# EAGLE design AND_D001A (EAGLE 7.4.0)
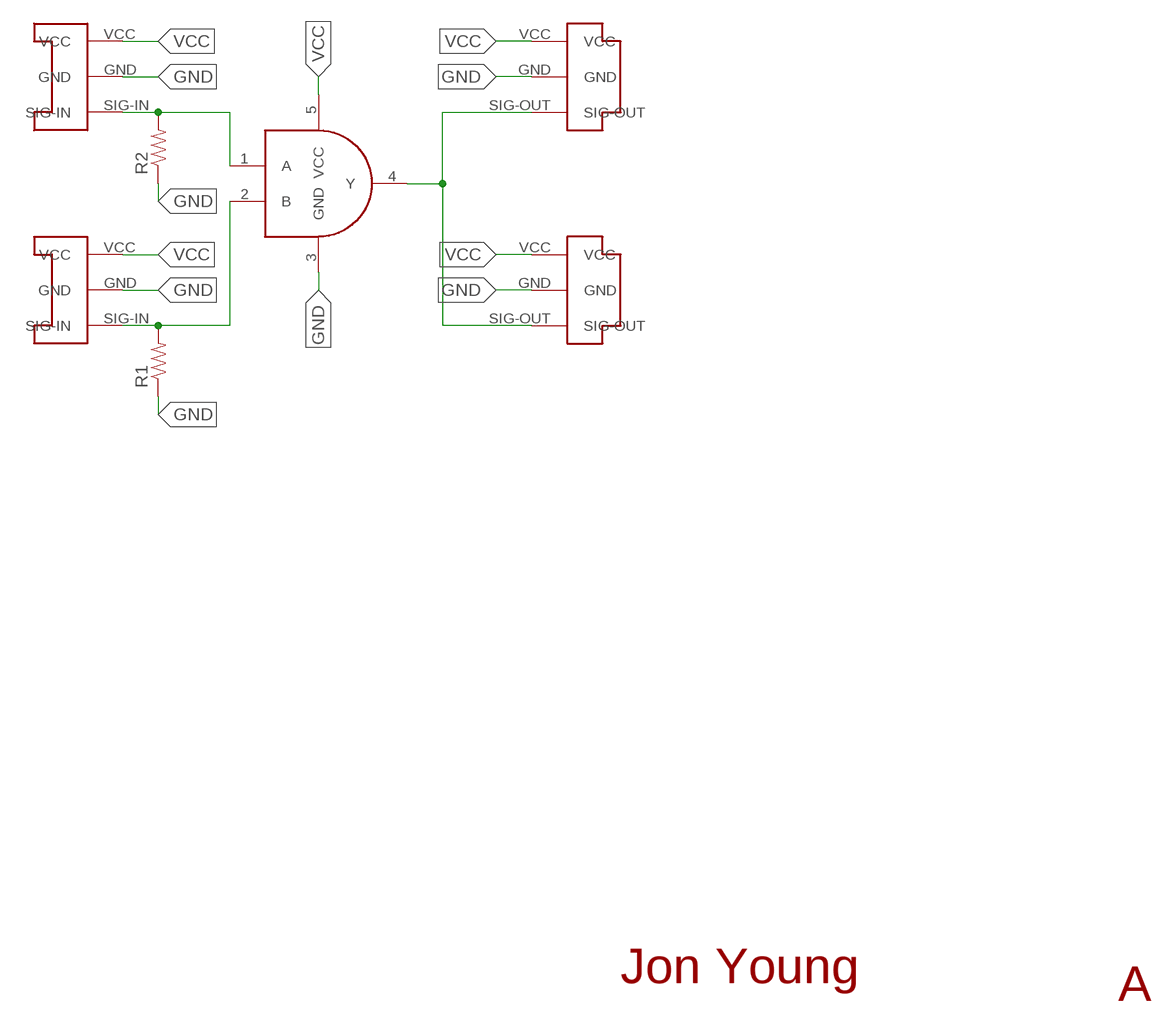
[diagram p0: schematic, sheet 1]

## Parts
R1  RESISTOR0603  [0603-RES]
R2  RESISTOR0603  [0603-RES]
U$1  CONN-PLUG-3POS-3MM  [PLUG-3POS-3MM-SMD]
U$2  CONN-SOCKET-3POS-3MM  [SOCKET-3POS-3MM-SMD]
U$3  CONN-SOCKET-3POS-3MM  [SOCKET-3POS-3MM-SMD]
U$4  CONN-PLUG-3POS-3MM  [PLUG-3POS-3MM-SMD]
U$5  AND-NC7SZ08  [SC70]

## Nets
GND: R1.1 R2.1 U$1.GND U$2.GND U$3.GND U$4.GND U$5.3(GND)
N$6: R1.2 U$2.SIG-IN U$5.2(B)
N$8: R2.2 U$3.SIG-IN U$5.1(A)
SIG-OUT: U$1.SIG-OUT U$4.SIG-OUT U$5.4(Y)
VCC: U$1.VCC U$2.VCC U$3.VCC U$4.VCC U$5.5(VCC)

## Notes on the sheet
- Jon Young
- A

## Library data of the parts
R1 R2 = SparkFun-Resistors:RESISTOR: Resistor Basic schematic elements and footprints for 0603, 1206, and PTH resistors.
U$1 U$4 = EmbeddedPlayground:CONN-PLUG-3POS-3MM: Surface mount board to board connector. Female socket, 3 position.
U$2 U$3 = EmbeddedPlayground:CONN-SOCKET-3POS-3MM: Surface mount board to board connector. Female socket, 3 position.
U$5 = EmbeddedPlayground:AND-NC7SZ08

## Board
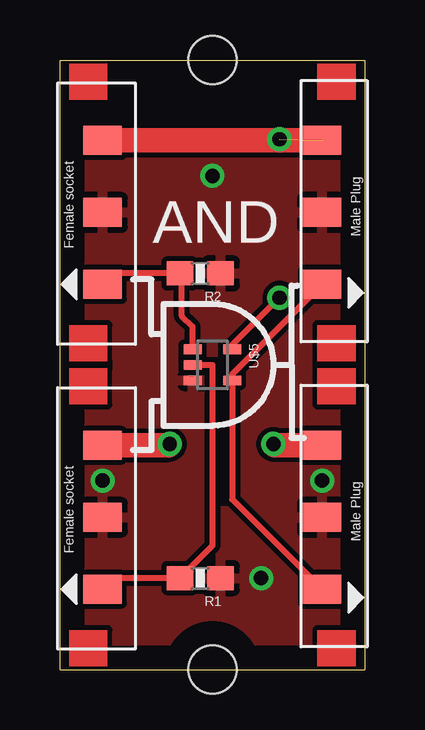
[diagram p1: board, top side]
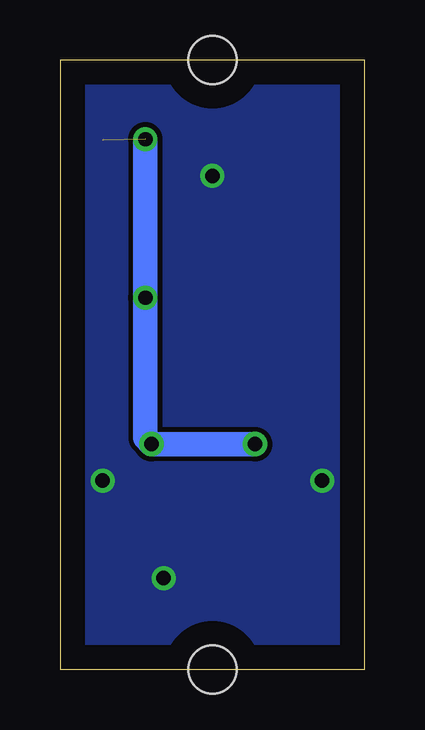
[diagram p2: board, bottom side, seen from below]

Size 12.7 x 25.4 mm. Coordinates in mm from the lower left corner, seen from the top.
Outline: 0,0 12.7,0 12.7,25.4 0,25.4 0,0
Copper layers (1*16): Top 0.035mm / dielectric 1.5mm / Bottom 0.035mm
Design rules "default": minimum track width 10mil, minimum drill 24mil, track to track 8mil, track to pad 8mil, pad to pad 8mil, via to via 8mil, smd to smd 8mil, copper to edge 40mil, drill to drill 8mil, minimum pad ring 10mil, minimum via ring 8mil, stop-mask expansion 4mil, vias tented up to drill 0mil, thermal gap 10mil
Holes 2 mm at 6.35,0 6.35,25.4

### Footprints (pad centres in the part's own frame; a part is rotated, then mirrored left to right if it is on the bottom)
0603-RES = smd 1.1 x 1: 1 -0.85,0; 2 0.85,0
PLUG-3POS-3MM-SMD = smd 1.2 x 1.6: GND 0,0; SIG-OUT 3,0; VCC -3,0
SOCKET-3POS-3MM-SMD = smd 1.2 x 1.6: GND 0,0; SIG-IN -3,0; VCC 3,0
SC70 = smd 0.4 x 0.75: 1 -0.65,-0.825; 2 0,-0.825; 3 0.65,-0.825; 4 0.65,0.825; 5 -0.65,0.825

### Placement (x,y rotation side)
R1  5.84,3.81 180 top
R2  5.84,16.51 180 top
U$1  10.92,6.35 270 top
U$2  1.78,6.35 90 top
U$3  1.78,19.05 90 top
U$4  10.92,19.05 270 top
U$5  6.35,12.7 270 top

### Tracks (layer width: path | path; a pad name or v marks a point on that pad's centre or on a via)
GND  (via drill 0.6)
  other vias: 1.78,7.87 10.92,7.87 8.38,3.81 6.35,20.57
  pour Top: -1.27,31.69 -1.27,-1.27 16.42,-1.27 16.42,31.69
  pour Bottom: -1.27,31.69 16.42,31.69 16.42,-1.27 -1.27,-1.27
N$6
  Top 0.254: U$2.SIG-IN 1.78,3.81 R1.2 6.35,5.17 6.35,12.7 U$5.2
N$8
  Top 0.254: U$3.SIG-IN 2.24,16.51 R2.2 5.08,16.42 5.08,14.73 5.53,14.29 U$5.1
SIG-OUT
  Top 0.254: U$4.SIG-OUT 7.17,12.3 U$5.4 7.17,7.1 U$1.SIG-OUT
VCC  (via drill 0.6)  (1 unrouted)
  Top 0.254: U$5.5 7.17,13.53 v9.14,15.49
  Top 1.016: U$2.VCC 4.52,9.35 v4.57,9.4 | U$1.VCC 8.94,9.35 v8.89,9.4 | U$3.VCC U$4.VCC
  Bottom 1.016: v4.57,9.4 v8.89,9.4 9.14,9.65 v9.14,15.49 v9.14,22.1

### Text on the board
tPlace: AND